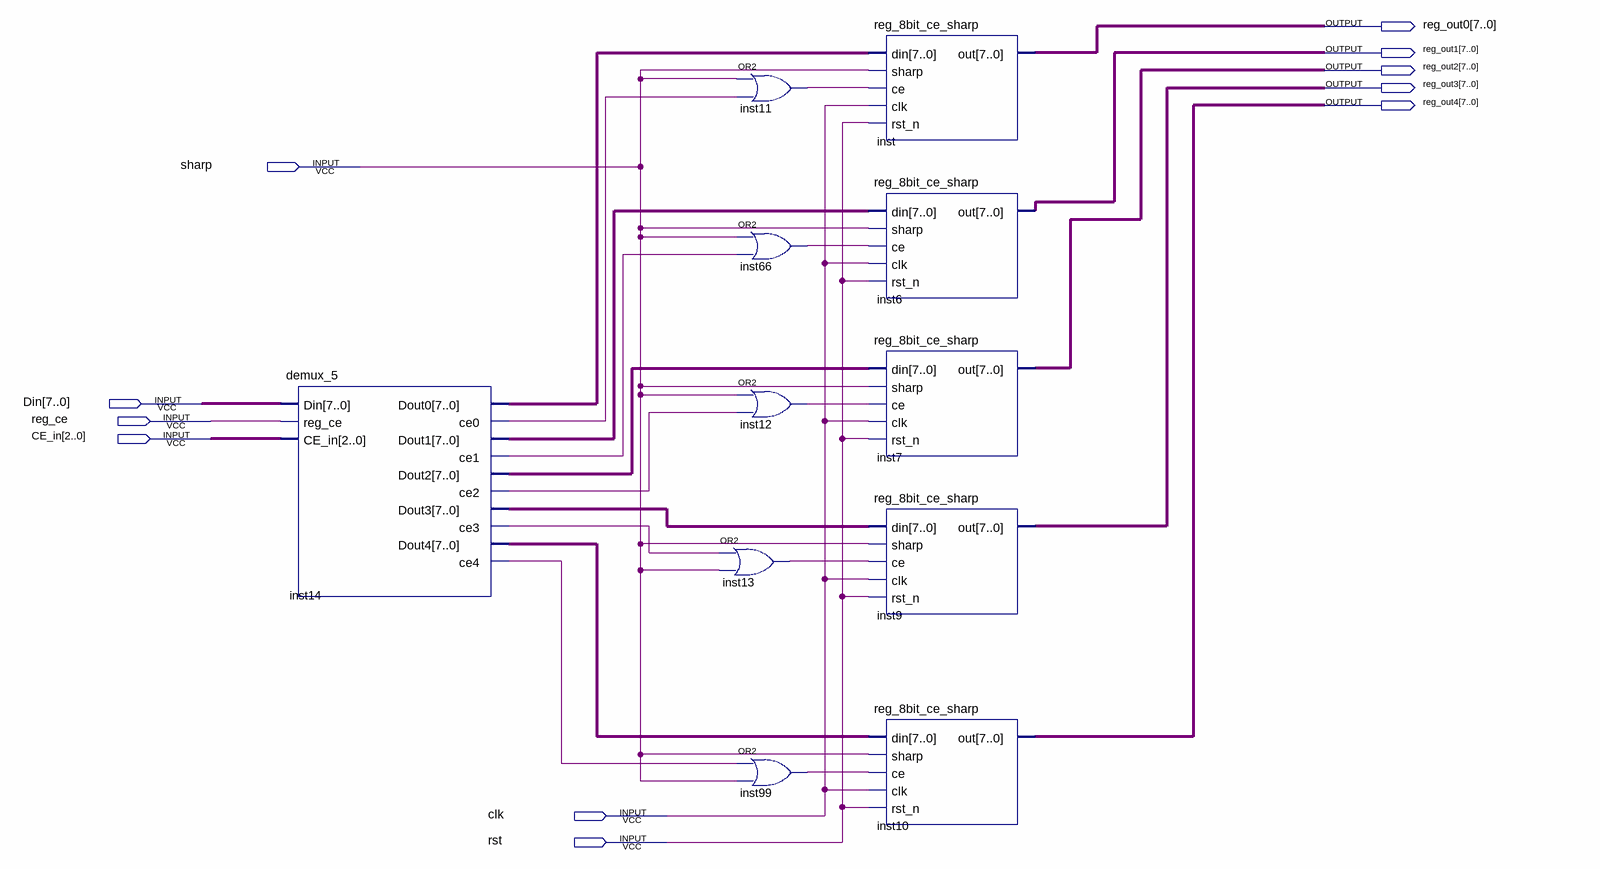
[diagram p0: schematic sheet]
// Quartus schematic RAM_5.bdf as structural Verilog: 11 symbols, 11 pins
module RAM_5 (
  input  sharp,
  input  [7:0] Din,
  input  reg_ce,
  input  [2:0] CE_in,
  input  clk,
  input  rst,
  output [7:0] reg_out0,
  output [7:0] reg_out1,
  output [7:0] reg_out2,
  output [7:0] reg_out3,
  output [7:0] reg_out4
);

  wire inst11_out, inst12_out, inst13_out, inst14_ce0, inst14_ce1, inst14_ce2, inst14_ce3, inst14_ce4,
       inst66_out, inst99_out;
  wire [7:0] inst14_dout0, inst14_dout1, inst14_dout2, inst14_dout3, inst14_dout4;

  demux_5 inst14 (
    .Din(Din), .reg_ce(reg_ce), .CE_in(CE_in), .Dout0(inst14_dout0), .ce0(inst14_ce0), .Dout1(inst14_dout1),
    .ce1(inst14_ce1), .Dout2(inst14_dout2), .ce2(inst14_ce2), .Dout3(inst14_dout3), .ce3(inst14_ce3),
    .Dout4(inst14_dout4), .ce4(inst14_ce4));
  or inst11 (inst11_out, sharp, inst14_ce0);
  or inst66 (inst66_out, sharp, inst14_ce1);
  or inst12 (inst12_out, sharp, inst14_ce2);
  or inst13 (inst13_out, inst14_ce3, sharp);
  or inst99 (inst99_out, inst14_ce4, sharp);
  reg_8bit_ce_sharp inst (.din(inst14_dout0), .sharp(sharp), .ce(inst11_out), .clk(clk), .rst_n(rst), .out(reg_out0));
  reg_8bit_ce_sharp inst6 (.din(inst14_dout1), .sharp(sharp), .ce(inst66_out), .clk(clk), .rst_n(rst), .out(reg_out1));
  reg_8bit_ce_sharp inst7 (.din(inst14_dout2), .sharp(sharp), .ce(inst12_out), .clk(clk), .rst_n(rst), .out(reg_out2));
  reg_8bit_ce_sharp inst9 (.din(inst14_dout3), .sharp(sharp), .ce(inst13_out), .clk(clk), .rst_n(rst), .out(reg_out3));
  reg_8bit_ce_sharp inst10 (.din(inst14_dout4), .sharp(sharp), .ce(inst99_out), .clk(clk), .rst_n(rst), .out(reg_out4));
endmodule
